# EAGLE design Bus IO and Centronics Card (EAGLE 6.5.0)
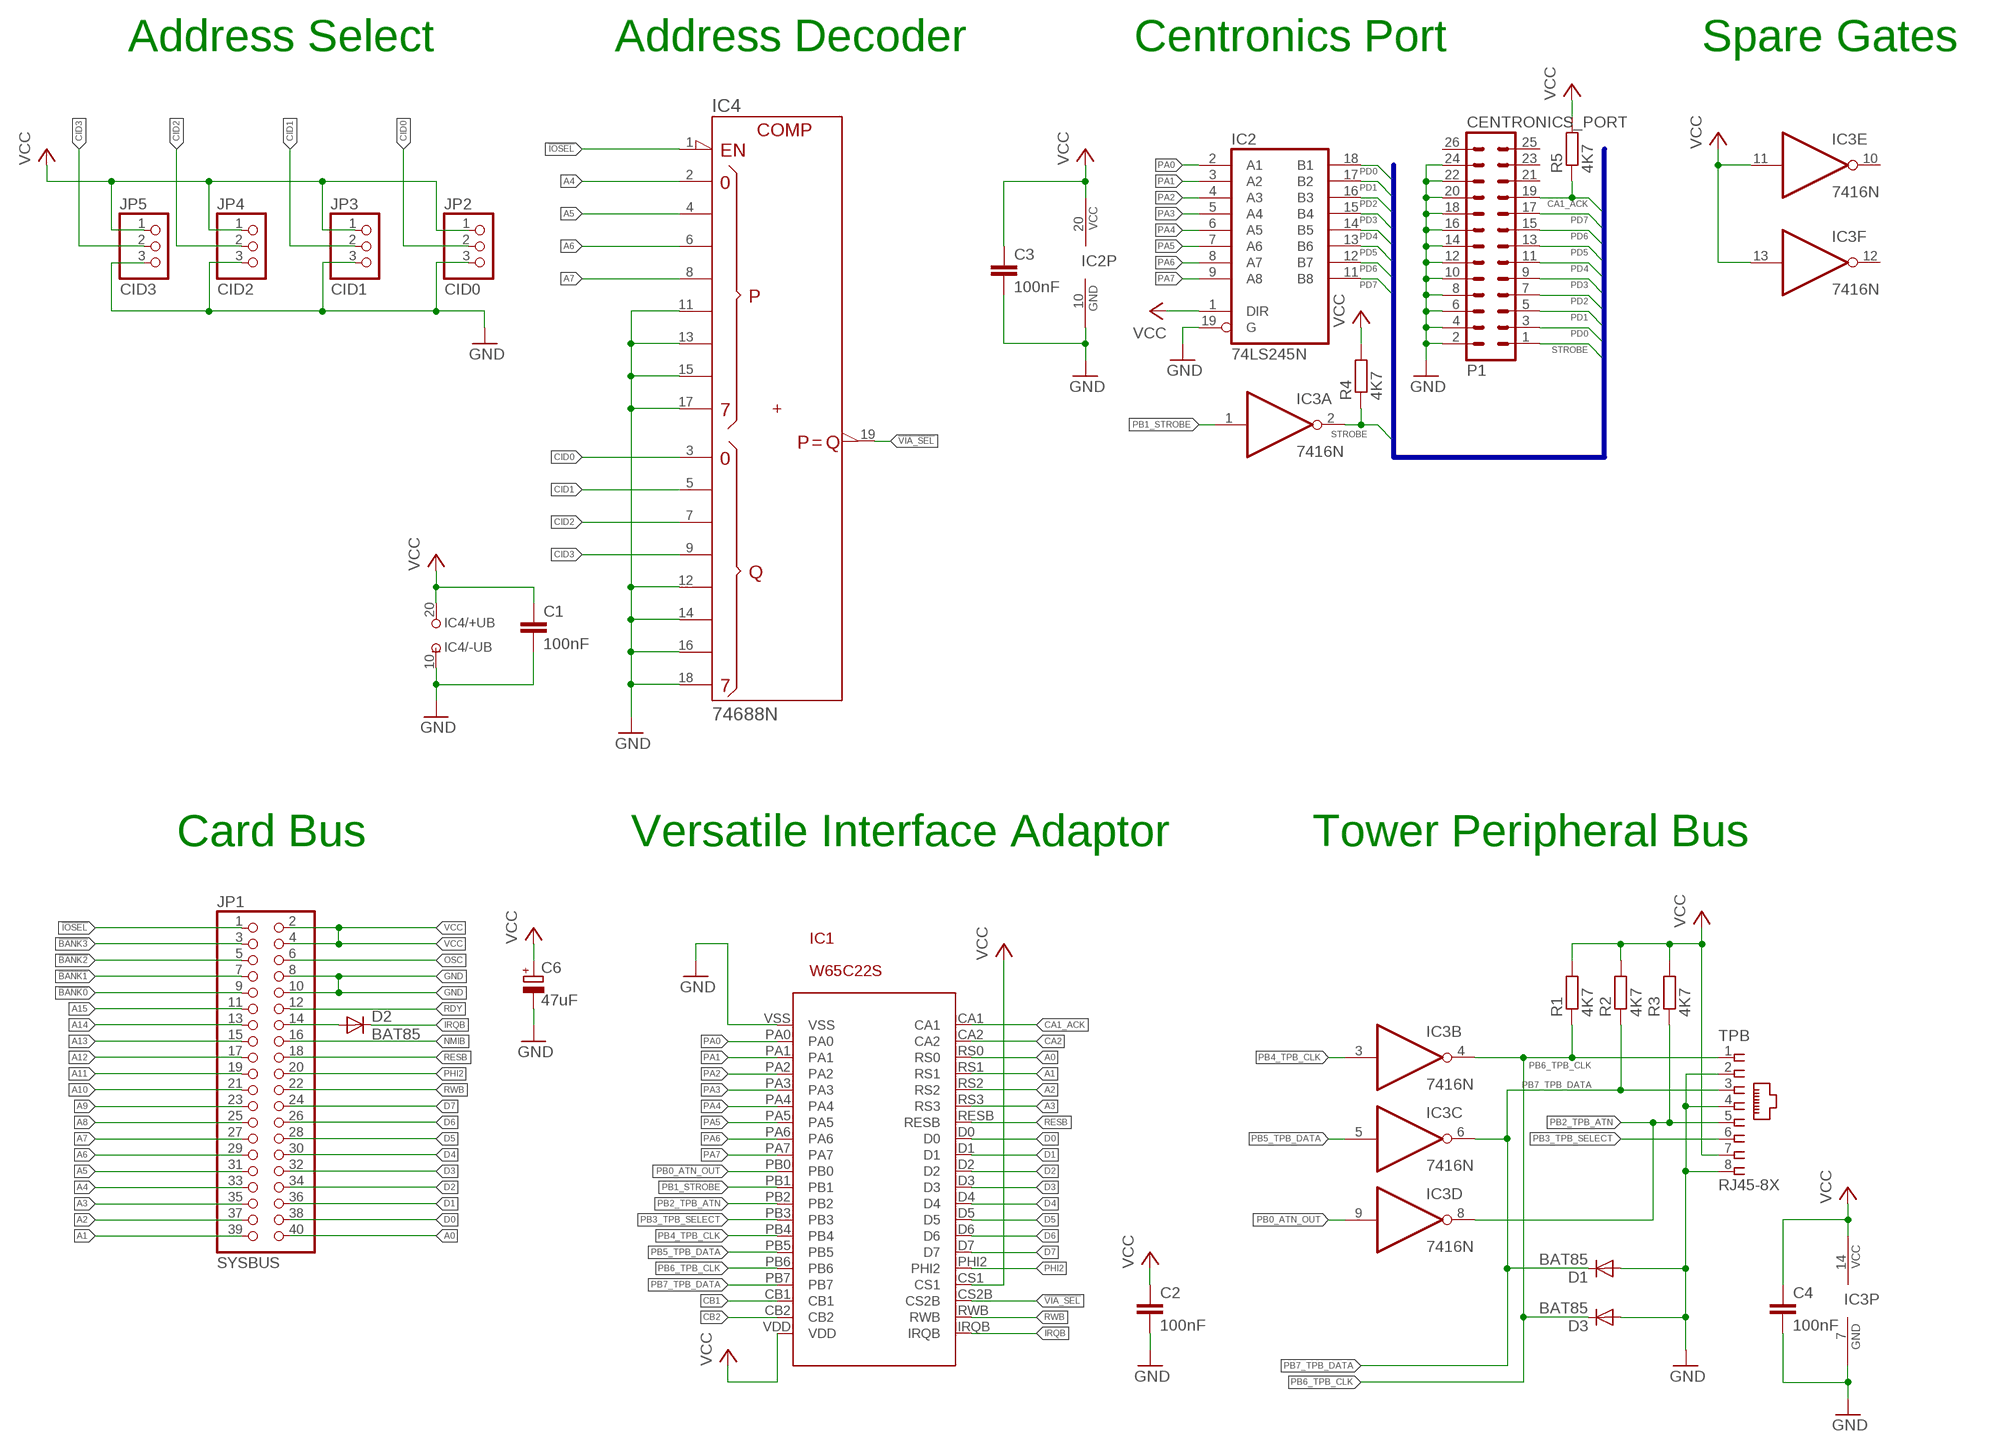
[diagram p0: schematic, sheet 1]

## Parts
C1  100nF  C-EU050-025X075  [C050-025X075]
C2  100nF  C-EU050-025X075  [C050-025X075]
C3  100nF  C-EU050-025X075  [C050-025X075]
C4  100nF  C-EU050-025X075  [C050-025X075]
C6  47uF  CPOL-EUE2.5-7  [E2,5-7]
CENTRONICS_PORT  P1  ML26L  [ML26L]
D1  BAT85  BAT81  [DO34-7]
D2  BAT85  BAT81  [DO34-7]
D3  BAT85  BAT81  [DO34-7]
IC1  W65C22S  W65C22  [W65C22-DIP]
IC2  74LS245N  [DIL20]
IC3  7416N  [DIL14]
IC4  74688N  [DIL20]
JP1  SYSBUS  PINHD-2X20/90  [2X20/90]
JP2  CID0  PINHD-1X3  [1X03]
JP3  CID1  PINHD-1X3  [1X03]
JP4  CID2  PINHD-1X3  [1X03]
JP5  CID3  PINHD-1X3  [1X03]
R1  4K7  R-EU_0207/10  [0207/10]
R2  4K7  R-EU_0207/10  [0207/10]
R3  4K7  R-EU_0207/10  [0207/10]
R4  4K7  R-EU_0207/10  [0207/10]
R5  4K7  R-EU_0207/10  [0207/10]
TPB  RJ45-8X  [RJ45-NO-SHIELD]

## Nets
!BANK0: JP1.9
!BANK1: JP1.7
!BANK2: JP1.5
!BANK3: JP1.3
!IOSEL: IC4.1(!G) JP1.1
!VIA_SEL: IC1.CS2B IC4.19(!P=Q)
A0: IC1.RS0 JP1.40
A1: IC1.RS1 JP1.39
A2: IC1.RS2 JP1.37
A3: IC1.RS3 JP1.35
A4: IC4.2(P0) JP1.33
A5: IC4.4(P1) JP1.31
A6: IC4.6(P2) JP1.29
A7: IC4.8(P3) JP1.27
A8: JP1.25
A9: JP1.23
A10: JP1.21
A11: JP1.19
A12: JP1.17
A13: JP1.15
A14: JP1.13
A15: JP1.11
CA1_ACK: CENTRONICS_PORT.19 IC1.CA1 R5.1
CA2: IC1.CA2
CB1: IC1.CB1
CB2: IC1.CB2
CID0: IC4.3(Q0) JP2.2
CID1: IC4.5(Q1) JP3.2
CID2: IC4.7(Q2) JP4.2
CID3: IC4.9(Q3) JP5.2
D0: IC1.D0 JP1.38
D1: IC1.D1 JP1.36
D2: IC1.D2 JP1.34
D3: IC1.D3 JP1.32
D4: IC1.D4 JP1.30
D5: IC1.D5 JP1.28
D6: IC1.D6 JP1.26
D7: IC1.D7 JP1.24
GND: C1.2 C2.2 C3.2 C4.2 C6.- CENTRONICS_PORT.2 CENTRONICS_PORT.4 CENTRONICS_PORT.6 CENTRONICS_PORT.8 CENTRONICS_PORT.10 CENTRONICS_PORT.12 CENTRONICS_PORT.14 CENTRONICS_PORT.16 CENTRONICS_PORT.18 CENTRONICS_PORT.20 CENTRONICS_PORT.22 CENTRONICS_PORT.24 D1.A D3.A IC1.VSS IC2.10(GND) IC2.19(G) IC3.7(P:GND) IC4.10(-UB) IC4.11(P4) IC4.12(Q4) IC4.13(P5) IC4.14(Q5) IC4.15(P6) IC4.16(Q6) IC4.17(P7) IC4.18(Q7) JP1.8 JP1.10 JP2.3 JP3.3 JP4.3 JP5.3 TPB.2 TPB.4 TPB.8
IRQB: D2.C IC1.IRQB
N$1: D2.A JP1.14
NMIB: JP1.16
OSC: JP1.6
PA0: IC1.PA0 IC2.2(A1)
PA1: IC1.PA1 IC2.3(A2)
PA2: IC1.PA2 IC2.4(A3)
PA3: IC1.PA3 IC2.5(A4)
PA4: IC1.PA4 IC2.6(A5)
PA5: IC1.PA5 IC2.7(A6)
PA6: IC1.PA6 IC2.8(A7)
PA7: IC1.PA7 IC2.9(A8)
PB0_ATN_OUT: IC1.PB0 IC3.9(D:I)
PB1_STROBE: IC1.PB1 IC3.1(A:I)
PB2_TPB_ATN: IC1.PB2 IC3.8(D:O) R3.1 TPB.5
PB3_TPB_SELECT: IC1.PB3 TPB.6
PB4_TPB_CLK: IC1.PB4 IC3.3(B:I)
PB5_TPB_DATA: IC1.PB5 IC3.5(C:I)
PB6_TPB_CLK: D3.C IC1.PB6 IC3.4(B:O) R1.1 TPB.1
PB7_TPB_DATA: D1.C IC1.PB7 IC3.6(C:O) R2.1 TPB.3
PD0: CENTRONICS_PORT.3 IC2.18(B1)
PD1: CENTRONICS_PORT.5 IC2.17(B2)
PD2: CENTRONICS_PORT.7 IC2.16(B3)
PD3: CENTRONICS_PORT.9 IC2.15(B4)
PD4: CENTRONICS_PORT.11 IC2.14(B5)
PD5: CENTRONICS_PORT.13 IC2.13(B6)
PD6: CENTRONICS_PORT.15 IC2.12(B7)
PD7: CENTRONICS_PORT.17 IC2.11(B8)
PHI2: IC1.PHI2 JP1.20
RDY: JP1.12
RESB: IC1.RESB JP1.18
RWB: IC1.RWB JP1.22
STROBE: CENTRONICS_PORT.1 IC3.2(A:O) R4.1
VCC: C1.1 C2.1 C3.1 C4.1 C6.+ IC1.CS1 IC1.VDD IC2.1(DIR) IC2.20(VCC) IC3.11(E:I) IC3.13(F:I) IC3.14(P:VCC) IC4.20(+UB) JP1.2 JP1.4 JP2.1 JP3.1 JP4.1 JP5.1 R1.2 R2.2 R3.2 R4.2 R5.2 TPB.7
Unconnected: CENTRONICS_PORT.21 CENTRONICS_PORT.23 CENTRONICS_PORT.25 CENTRONICS_PORT.26 IC3.10(E:O) IC3.12(F:O)

## Buses
PD[0..7],STROBE,CA1_ACK

## Notes on the sheet
- Address Select | Address Decoder | Centronics Port | Spare Gates
- Card Bus | Versatile Interface Adaptor | Tower Peripheral Bus

## Library data of the parts
C1-C4 = rcl:C-EU: CAPACITOR, European symbol
C6 = rcl:CPOL-EU: POLARIZED CAPACITOR, European symbol
CENTRONICS_PORT = con-ml:ML26L: HARTING; OC_FARNELL: unknown; OC_NEWARK: unknown
D1-D3 = diode:BAT81: DIODE barrier diode
IC1 = W65XX Support:W65C22
IC2 = 74xx-us:74*245: Octal BUS TRANSCEIVER, 3-state
IC3 = 74xx-us:74*16: Hex INVERTER, open collector, high-voltage
IC4 = 74ttl-din:74*688: 8-bit MAGNITUDE/IDENTITY COMPARATOR, totem pole
JP1 = pinhead:PINHD-2X20: PIN HEADER
JP2-JP5 = pinhead:PINHD-1X3: PIN HEADER
R1-R5 = rcl:R-EU_: RESISTOR, European symbol
TPB = con-tycoelectronics:RJ45: CORCOM Modular RJ Jacks No Shield Source: www.tycoelectronics.com .. ENG_DS_1654001_1099_RJ_L_0507.pdf; MPN: RJ45-8X; OC_FARNELL: unknown; OC_NEWARK: 16R6101

## Board
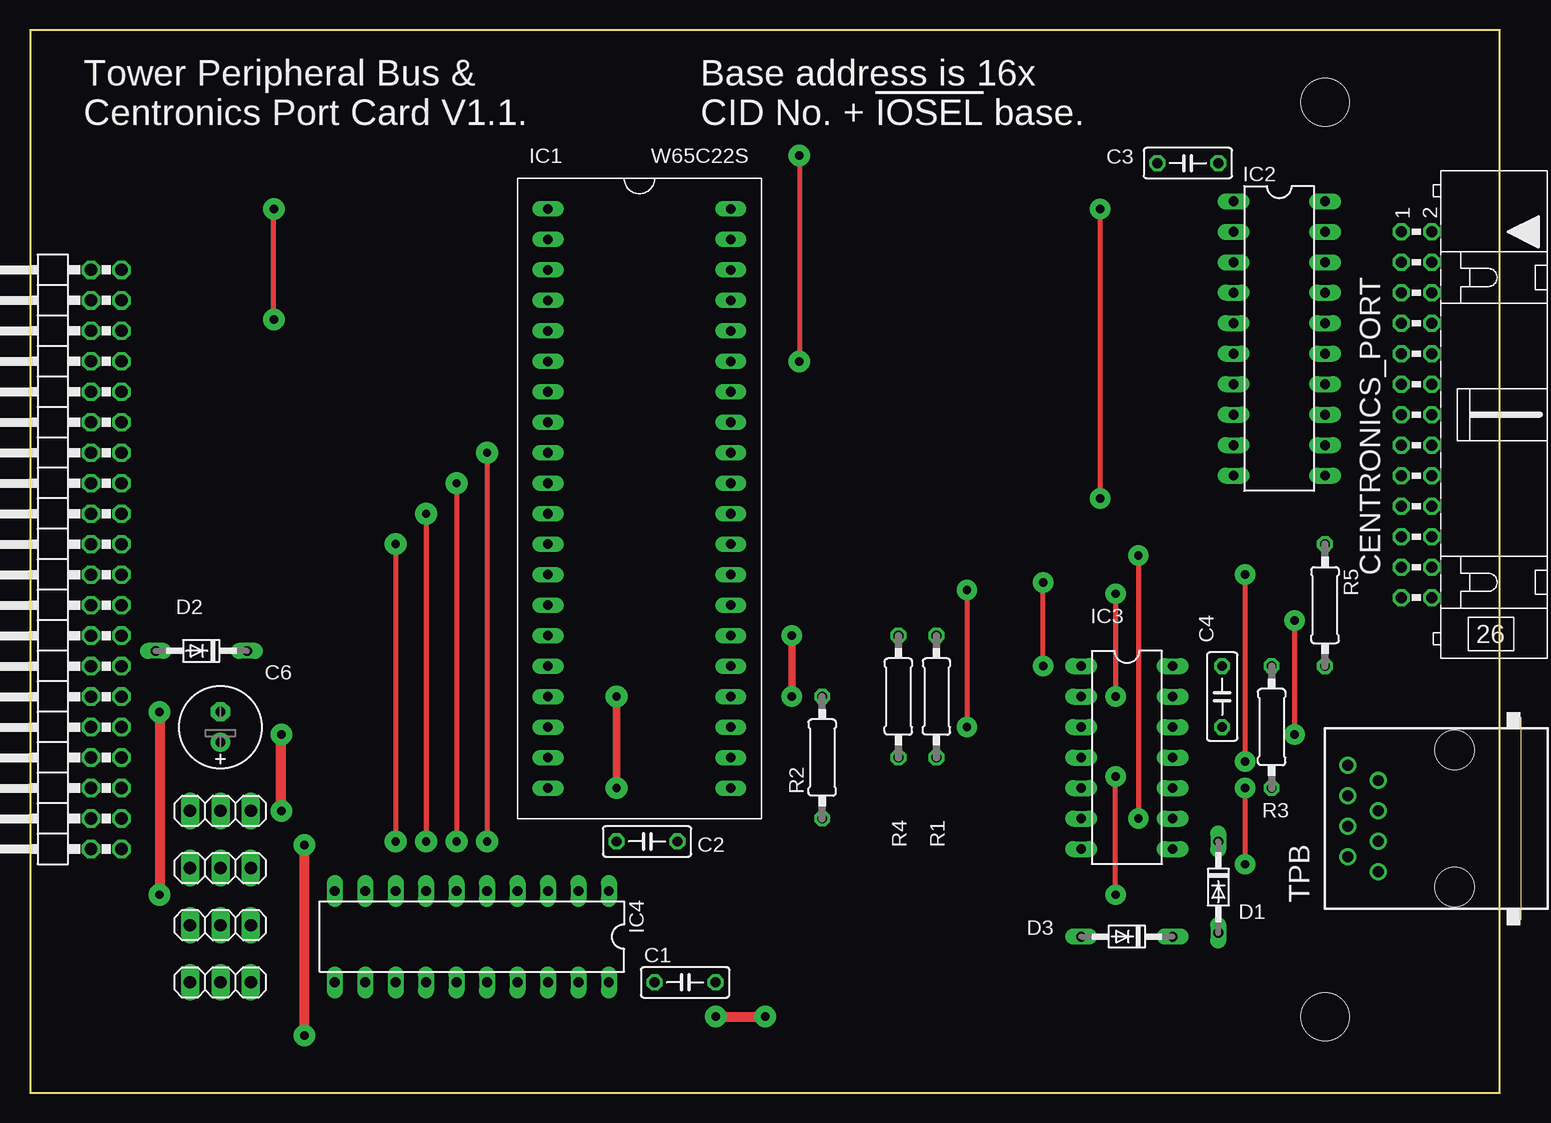
[diagram p1: board, top side]
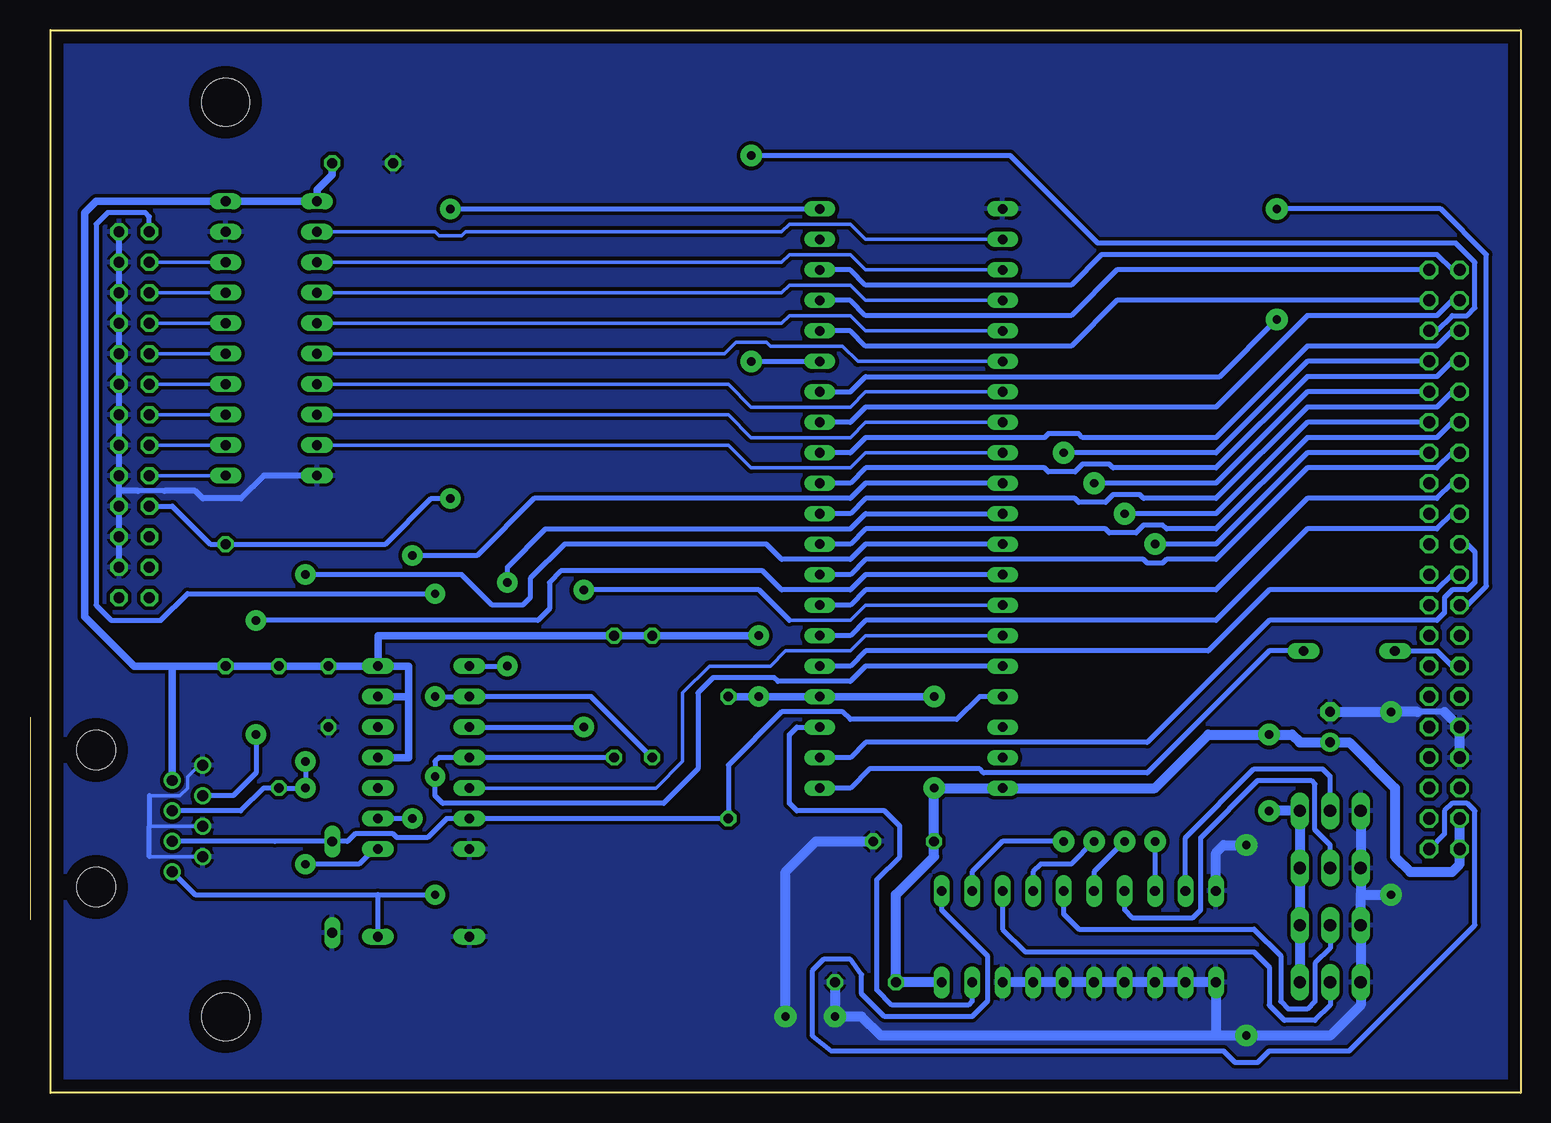
[diagram p2: board, bottom side, seen from below]

Size 122.53 x 88.57 mm. Coordinates in mm from the lower left corner, seen from the top.
Outline: 0,0 122.53,0 122.53,88.57 0,88.57 0,0
Copper layers (1*16): Top 0.035mm / dielectric 1.5mm / Bottom 0.035mm
Design rules "default *": minimum track width 10mil, minimum drill 24mil, track to track 8mil, track to pad 8mil, pad to pad 8mil, via to via 8mil, smd to smd 8mil, copper to edge 40mil, drill to drill 8mil, minimum pad ring 10mil, minimum via ring 8mil, stop-mask expansion 4mil, vias tented up to drill 0mil, thermal gap 10mil
Holes 4 mm at 107.95,82.55 107.95,6.35

### Footprints (pad centres in the part's own frame; a part is rotated, then mirrored left to right if it is on the bottom)
C050-025X075 = drill 0.813 octagon: 1 -2.54,0; 2 2.54,0
E2,5-7 = drill 0.813 pad 1.6: + -1.27,0 | drill 0.813 pad 1.6 octagon: - 1.27,0
ML26L = drill 0.914 octagon: 1 -15.24,-1.27; 2 -15.24,1.27; 3 -12.7,-1.27; 4 -12.7,1.27; 5 -10.16,-1.27; 6 -10.16,1.27; 7 -7.62,-1.27; 8 -7.62,1.27; 9 -5.08,-1.27; 10 -5.08,1.27; 11 -2.54,-1.27; 12 -2.54,1.27; 13 0,-1.27; 14 0,1.27; 15 2.54,-1.27; 16 2.54,1.27; 17 5.08,-1.27; 18 5.08,1.27; 19 7.62,-1.27; 20 7.62,1.27; 21 10.16,-1.27; 22 10.16,1.27; 23 12.7,-1.27; 24 12.7,1.27; 25 15.24,-1.27; 26 15.24,1.27
DO34-7 = drill 0.813 long: A 3.81,0; C -3.81,0
W65C22-DIP = drill 0.8 long: CA1 7.62,24.13; CA2 7.62,21.59; CB1 -7.62,-19.05; CB2 -7.62,-21.59; CS1 7.62,-16.51; CS2B 7.62,-19.05; D0 7.62,6.35; D1 7.62,3.81; D2 7.62,1.27; D3 7.62,-1.27; D4 7.62,-3.81; D5 7.62,-6.35; D6 7.62,-8.89; D7 7.62,-11.43; IRQB 7.62,-24.13; PA0 -7.62,21.59; PA1 -7.62,19.05; PA2 -7.62,16.51; PA3 -7.62,13.97; PA4 -7.62,11.43; PA5 -7.62,8.89; PA6 -7.62,6.35; PA7 -7.62,3.81; PB0 -7.62,1.27; PB1 -7.62,-1.27; PB2 -7.62,-3.81; PB3 -7.62,-6.35; PB4 -7.62,-8.89; PB5 -7.62,-11.43; PB6 -7.62,-13.97; PB7 -7.62,-16.51; PHI2 7.62,-13.97; RESB 7.62,8.89; RS0 7.62,19.05; RS1 7.62,16.51; RS2 7.62,13.97; RS3 7.62,11.43; RWB 7.62,-21.59; VDD -7.62,-24.13; VSS -7.62,24.13
DIL20 = drill 0.813 long: 1 -11.43,-3.81; 2 -8.89,-3.81; 3 -6.35,-3.81; 4 -3.81,-3.81; 5 -1.27,-3.81; 6 1.27,-3.81; 7 3.81,-3.81; 8 6.35,-3.81; 9 8.89,-3.81; 10 11.43,-3.81; 11 11.43,3.81; 12 8.89,3.81; 13 6.35,3.81; 14 3.81,3.81; 15 1.27,3.81; 16 -1.27,3.81; 17 -3.81,3.81; 18 -6.35,3.81; 19 -8.89,3.81; 20 -11.43,3.81
DIL14 = drill 0.813 long: 1 -7.62,-3.81; 2 -5.08,-3.81; 3 -2.54,-3.81; 4 0,-3.81; 5 2.54,-3.81; 6 5.08,-3.81; 7 7.62,-3.81; 8 7.62,3.81; 9 5.08,3.81; 10 2.54,3.81; 11 0,3.81; 12 -2.54,3.81; 13 -5.08,3.81; 14 -7.62,3.81
2X20/90 = drill 1.016 octagon: 1 -24.13,-6.35; 2 -24.13,-3.81; 3 -21.59,-6.35; 4 -21.59,-3.81; 5 -19.05,-6.35; 6 -19.05,-3.81; 7 -16.51,-6.35; 8 -16.51,-3.81; 9 -13.97,-6.35; 10 -13.97,-3.81; 11 -11.43,-6.35; 12 -11.43,-3.81; 13 -8.89,-6.35; 14 -8.89,-3.81; 15 -6.35,-6.35; 16 -6.35,-3.81; 17 -3.81,-6.35; 18 -3.81,-3.81; 19 -1.27,-6.35; 20 -1.27,-3.81; 21 1.27,-6.35; 22 1.27,-3.81; 23 3.81,-6.35; 24 3.81,-3.81; 25 6.35,-6.35; 26 6.35,-3.81; 27 8.89,-6.35; 28 8.89,-3.81; 29 11.43,-6.35; 30 11.43,-3.81; 31 13.97,-6.35; 32 13.97,-3.81; 33 16.51,-6.35; 34 16.51,-3.81; 35 19.05,-6.35; 36 19.05,-3.81; 37 21.59,-6.35; 38 21.59,-3.81; 39 24.13,-6.35; 40 24.13,-3.81
1X03 = drill 1.016 long: 1 -2.54,0; 2 0,0; 3 2.54,0
0207/10 = drill 0.813 octagon: 1 -5.08,0; 2 5.08,0
RJ45-NO-SHIELD = drill 0.9 pad 1.4: 1 -4.445,6.35; 2 -3.175,8.89; 3 -1.905,6.35; 4 -0.635,8.89; 5 0.635,6.35; 6 1.905,8.89; 7 3.175,6.35; 8 4.445,8.89 | hole 3.251: -5.715,0; 5.715,0

### Placement (x,y rotation side)
C1  54.61,9.21 0 top
C2  51.44,20.95 0 top
C3  96.52,77.47 180 top
C4  99.38,33.02 270 top
C6  15.88,30.48 90 top
CENTRONICS_PORT  115.57,56.52 270 top
D1  99.06,17.14 270 top
D2  14.29,36.83 180 top
D3  91.44,13.02 180 top
IC1  50.8,49.53 0 top
IC2  104.14,62.87 270 top
IC3  91.44,27.94 270 top
IC4  36.83,13.02 180 top
JP1  1.27,44.45 90 top
JP2  15.88,9.21 180 top
JP3  15.88,13.97 180 top
JP4  15.88,18.73 180 top
JP5  15.88,23.5 180 top
R1  75.56,33.02 90 top
R2  66.04,27.94 90 top
R3  103.5,30.48 90 top
R4  72.39,33.02 90 top
R5  107.95,40.64 270 top
TPB  118.75,22.86 90 top

### Tracks (layer width: path | path; a pad name or v marks a point on that pad's centre or on a via)
!IOSEL
  Bottom 0.406: IC4.1 48.26,15.24 44.45,11.43 44.45,7.62 45.72,6.35 53.02,6.35 54.93,8.26 54.93,9.84 55.88,11.11 58.1,11.11 59.05,10.16 59.05,4.76 57.47,3.49 24.77,3.49 23.81,2.54 21.91,2.54 20.95,3.49 14.29,3.49 3.81,13.97 3.81,23.5 4.45,24.13 5.71,24.13 6.35,23.5 6.35,21.59 JP1.1
!VIA_SEL
  Bottom 0.406: IC4.19 45.72,7.62 46.04,7.3 52.39,7.3 53.66,8.57 53.66,17.78 51.75,19.68 51.75,22.23 53.02,23.5 60.33,23.5 60.96,24.13 60.96,29.84 60.33,30.48 IC1.CS2B
A0
  Bottom 0.406: JP1.40 5.71,68.58 6.99,69.85 34.92,69.85 37.47,67.31 54.61,67.31 55.88,68.58 IC1.RS0
A1
  Bottom 0.406: JP1.39 33.66,68.58 37.47,64.77 54.61,64.77 55.88,66.04 IC1.RS1
A2
  Bottom 0.406: JP1.37 33.66,66.04 37.47,62.23 54.61,62.23 55.88,63.5 IC1.RS2
A3  (via drill 0.7 pad 1.8)
  Top 0.406: v64.14,78.11 v64.14,60.96
  Bottom 0.406: JP1.35 6.99,63.5 5.71,64.77 4.45,64.77 3.81,65.41 3.81,69.22 5.4,70.8 35.24,70.8 42.55,78.11 v64.14,78.11 | v64.14,60.96 IC1.RS3
A4  (via drill 0.7 pad 1.8)
  Top 0.406: v38.1,53.34 v38.1,20.95
  Bottom 0.406: JP1.33 17.78,60.96 25.4,53.34 v38.1,53.34 | v38.1,20.95 43.18,20.95 45.72,18.41 IC4.2
A5  (via drill 0.7 pad 1.8)
  Top 0.406: v35.56,50.8 v35.56,20.95
  Bottom 0.406: JP1.31 17.78,58.42 25.4,50.8 v35.56,50.8 | IC4.4 40.64,18.41 40.01,19.05 37.47,19.05 v35.56,20.95
A6  (via drill 0.7 pad 1.8)
  Top 0.406: v33.02,48.26 v33.02,20.95
  Bottom 0.406: JP1.29 17.78,55.88 25.4,48.26 v33.02,48.26 | v33.02,20.95 35.56,18.41 IC4.6
A7  (via drill 0.7 pad 1.8)
  Top 0.406: v30.48,45.72 v30.48,20.95
  Bottom 0.406: JP1.27 17.78,53.34 25.4,45.72 v30.48,45.72 | v30.48,20.95 IC4.8
CA1_ACK  (via drill 0.7 pad 1.7)
  Top 0.406: v89.22,49.53 v89.22,73.66
  Bottom 0.406: CENTRONICS_PORT.19 112.39,48.9 109.22,45.72 R5.1 94.61,45.72 90.81,49.53 v89.22,49.53 | v89.22,73.66 IC1.CA1
CID0
  Bottom 0.406: JP2.2 15.88,7.3 17.14,6.03 19.68,6.03 20.95,7.3 20.95,10.48 22.23,11.75 41.27,11.75 43.18,13.65 IC4.3
CID1
  Bottom 0.406: JP3.2 15.88,12.06 17.14,10.79 17.14,7.62 17.78,6.99 19.37,6.99 20,7.62 20,11.43 22.23,13.65 36.83,13.65 38.1,14.92 IC4.5
CID2
  Bottom 0.406: JP4.2 15.88,20.64 17.14,21.91 17.14,25.72 17.46,26.04 21.91,26.04 26.67,21.27 26.67,15.24 27.3,14.61 32.38,14.61 33.02,15.24 IC4.7
CID3
  Bottom 0.406: JP5.2 15.88,26.35 16.51,26.99 22.23,26.99 27.94,21.27 IC4.9
D0
  Bottom 0.406: JP1.38 5.71,66.04 6.99,64.77 17.78,64.77 25.4,57.15 54.61,57.15 55.88,55.88 IC1.D0
D1
  Bottom 0.406: JP1.36 5.71,63.5 6.99,62.23 17.78,62.23 25.4,54.61 36.51,54.61 36.83,54.93 39.37,54.93 39.69,54.61 54.61,54.61 55.88,53.34 IC1.D1
D2
  Bottom 0.406: JP1.34 5.71,60.96 6.99,59.69 17.78,59.69 25.4,52.07 33.97,52.07 34.29,52.39 36.51,52.39 37.15,51.75 39.37,51.75 39.69,52.07 54.61,52.07 55.88,50.8 IC1.D2
D3
  Bottom 0.406: JP1.32 5.71,58.42 6.99,57.15 17.78,57.15 25.4,49.53 31.43,49.53 31.75,49.85 33.97,49.85 34.61,49.21 36.83,49.21 37.15,49.53 54.61,49.53 55.88,48.26 IC1.D3
D4
  Bottom 0.406: JP1.30 5.71,55.88 6.99,54.61 17.78,54.61 25.4,46.99 29.53,46.99 29.84,47.31 31.43,47.31 32.07,46.67 34.29,46.67 34.61,46.99 54.61,46.99 55.88,45.72 IC1.D4
D5
  Bottom 0.406: JP1.28 5.71,53.34 6.99,52.07 17.78,52.07 25.4,44.45 29.53,44.45 29.84,44.13 31.11,44.13 31.43,44.45 54.61,44.45 55.88,43.18 IC1.D5
D6
  Bottom 0.406: JP1.26 5.71,50.8 6.99,49.53 17.78,49.53 25.4,41.91 54.61,41.91 55.88,40.64 IC1.D6
D7
  Bottom 0.406: JP1.24 5.71,48.26 6.99,46.99 17.78,46.99 25.4,39.37 54.61,39.37 55.88,38.1 IC1.D7
GND  (via drill 0.7 pad 1.8)
  Top 0.813: v22.86,20.64 v22.86,4.76 | v57.15,6.35 v61.28,6.35 | v10.79,31.75 v10.79,16.51
  Bottom 0.305: TPB.4 114.3,22.23 | TPB.2 114.3,19.68 | 110.17,27.3 111.12,26.35 111.12,25.4 111.76,24.77 114.3,24.77
  Bottom 0.406: 113.03,50.16 115.25,50.16 | 114.3,19.68 114.3,22.23 114.3,24.77 | TPB.8 110.17,27.3
  Bottom 0.508: 6.35,31.75 8.57,31.75 | CENTRONICS_PORT.24 CENTRONICS_PORT.22 CENTRONICS_PORT.20 116.84,50.16 | 116.84,50.16 CENTRONICS_PORT.18 CENTRONICS_PORT.16 CENTRONICS_PORT.14 CENTRONICS_PORT.12 CENTRONICS_PORT.10 CENTRONICS_PORT.8 CENTRONICS_PORT.6 CENTRONICS_PORT.4 CENTRONICS_PORT.2 | IC2.10 104.78,51.44 106.68,49.53 109.86,49.53 110.49,50.16 113.03,50.16 | 115.25,50.16 116.84,50.16
  Bottom 0.813: IC4.18 IC4.17 IC4.16 IC4.15 IC4.14 IC4.13 IC4.12 IC4.11 25.4,4.76 | JP5.3 JP4.3 13.34,16.51 | 25.4,4.76 v22.86,4.76 15.88,4.76 13.34,7.3 JP2.3 JP3.3 13.34,16.51 | 25.4,4.76 53.34,4.76 54.93,6.35 v57.15,6.35 C1.2 | IC4.10 25.4,20 24.77,20.64 v22.86,20.64 | 6.35,31.75 JP1.10 JP1.8 | v61.28,6.35 61.28,18.41 58.74,20.95 C2.2 | C6.- v10.79,31.75 8.57,31.75 | 13.34,16.51 v10.79,16.51
  pour Bottom (isolate 0.305): 0,88.9 122.56,88.9 122.56,0 0,0
IRQB
  Bottom 0.406: IC1.IRQB 55.88,25.4 54.29,26.99 45.09,26.99 44.77,26.67 31.11,26.67 20.95,36.83 D2.C
N$1
  Bottom 0.406: JP1.14 5.71,35.56 6.99,36.83 D2.A
PA0
  Bottom 0.305: IC1.PA0 54.61,71.12 55.88,72.39 60.96,72.39 61.59,71.75 87.95,71.75 88.27,71.44 90.17,71.44 90.49,71.75 IC2.2
PA1
  Bottom 0.305: IC1.PA1 54.61,68.58 55.88,69.85 60.96,69.85 61.59,69.22 IC2.3
PA2
  Bottom 0.305: IC1.PA2 54.61,66.04 55.88,67.31 60.96,67.31 61.59,66.67 IC2.4
PA3
  Bottom 0.305: IC1.PA3 54.61,63.5 55.88,64.77 60.96,64.77 61.59,64.14 IC2.5
PA4
  Bottom 0.305: IC1.PA4 55.24,60.96 56.52,62.23 62.55,62.23 62.87,62.55 65.41,62.55 66.36,61.59 IC2.6
PA5
  Bottom 0.305: IC1.PA5 54.61,58.42 55.88,57.15 64.14,57.15 66.04,59.05 IC2.7
PA6
  Bottom 0.305: IC1.PA6 54.61,55.88 55.88,54.61 64.14,54.61 66.04,56.52 IC2.8
PA7
  Bottom 0.305: IC1.PA7 54.61,53.34 55.88,52.07 64.14,52.07 66.04,53.98 IC2.9
PB0_ATN_OUT  (via drill 0.7 pad 1.7)
  Top 0.406: v92.39,44.77 v92.39,22.86
  Bottom 0.406: IC1.PB0 54.61,50.8 55.88,49.53 82.23,49.53 87,44.77 v92.39,44.77 | v92.39,22.86 IC3.9
PB1_STROBE  (via drill 0.7 pad 1.7)
  Top 0.406: v84.45,35.56 v84.45,42.55
  Bottom 0.406: IC3.1 v84.45,35.56 | v84.45,42.55 84.45,43.81 81.28,46.99 55.88,46.99 54.61,48.26 IC1.PB1
PB2_TPB_ATN  (via drill 0.7 pad 1.7)
  Top 0.406: v101.28,43.18 v101.28,27.62 | v101.28,25.4 v101.28,19.05
  Bottom 0.406: TPB.5 106.68,23.5 104.78,25.4 R3.1 v101.28,25.4 v101.28,27.62 | IC1.PB2 54.61,45.72 55.88,44.45 61.59,44.45 62.87,45.72 79.69,45.72 82.55,42.86 82.55,41.27 83.19,40.64 85.72,40.64 88.27,43.18 v101.28,43.18 | IC3.8 95.57,20.32 96.84,19.05 v101.28,19.05
PB3_TPB_SELECT  (via drill 0.7 pad 1.7)
  Top 0.406: v105.41,39.37 v105.41,29.84
  Bottom 0.406: IC1.PB3 54.61,43.18 55.88,41.91 61.59,41.91 63.18,43.5 80.01,43.5 80.96,42.55 80.96,40.32 81.92,39.37 v105.41,39.37 | v105.41,29.84 105.41,26.67 107.31,24.77 TPB.6
PB4_TPB_CLK  (via drill 0.7 pad 1.7)
  Top 0.406: v78.11,41.91 v78.11,30.48
  Bottom 0.305: IC1.PB4 54.61,40.64 55.88,39.37 60.96,39.37
  Bottom 0.406: IC3.3 v78.11,30.48 | 60.96,39.37 63.5,41.91 v78.11,41.91
PB5_TPB_DATA
  Bottom 0.305: IC1.PB5 54.61,38.1 55.88,36.83 61.28,36.83 62.55,35.56 67.63,35.56 69.85,33.34 69.85,27.62 72.07,25.4 IC3.5
PB6_TPB_CLK  (via drill 0.7 pad 1.7)
  Top 0.406: v90.49,16.51 v90.49,26.35
  Bottom 0.406: IC1.PB6 54.61,35.56 55.88,34.29 61.91,34.29 62.23,34.61 67.31,34.61 68.58,33.34 68.58,26.99 71.44,24.13 89.85,24.13 90.49,24.77 v90.49,26.35 90.49,27.62 90.17,27.94 IC3.4 R1.1 | TPB.1 110.49,16.51 95.25,16.51 | 95.25,16.51 v90.49,16.51 | D3.C 95.25,16.51
PB7_TPB_DATA
  Bottom 0.406: IC1.PB7 45.09,33.02 46.99,31.11 55.88,31.11 56.52,31.75 61.59,31.75 66.04,27.3 R2.1 IC3.6 89.53,22.86 91.12,21.27 93.66,21.27 93.98,21.59 97.16,21.59 97.79,20.95 D1.C | D1.C TPB.3 | D1.C 103.82,20.95
PD0
  Bottom 0.305: IC2.18 CENTRONICS_PORT.3
PD1
  Bottom 0.305: IC2.17 CENTRONICS_PORT.5
PD2
  Bottom 0.305: IC2.16 CENTRONICS_PORT.7
PD3
  Bottom 0.305: IC2.15 CENTRONICS_PORT.9
PD4
  Bottom 0.305: IC2.14 CENTRONICS_PORT.11
PD5
  Bottom 0.305: IC2.13 CENTRONICS_PORT.13
PD6
  Bottom 0.305: IC2.12 CENTRONICS_PORT.15
PD7
  Bottom 0.305: IC2.11 CENTRONICS_PORT.17
PHI2
  Bottom 0.406: IC1.PHI2 55.88,35.56 54.61,36.83 26.04,36.83 20.95,41.91 6.99,41.91 5.71,43.18 JP1.20
RESB  (via drill 0.7 pad 1.8)
  Top 0.406: v20.32,64.45 v20.32,73.66
  Bottom 0.406: JP1.18 4.45,40.64 2.86,42.23 2.86,69.85 6.67,73.66 v20.32,73.66 | IC1.RESB 55.88,58.42 54.61,59.69 25.08,59.69 v20.32,64.45
RWB
  Bottom 0.406: JP1.22 4.45,45.72 3.81,45.09 3.81,42.55 4.45,41.91 5.71,41.91 6.35,41.27 6.35,40.01 6.99,39.37 20.95,39.37 31.11,29.21 54.61,29.21 55.88,27.94 IC1.RWB
STROBE  (via drill 0.7 pad 1.7)
  Top 0.406: v90.49,41.59 v90.49,33.02
  Bottom 0.406: CENTRONICS_PORT.1 114.3,73.03 114.62,73.34 117.79,73.34 118.75,72.39 118.75,40.64 117.47,39.37 113.35,39.37 111.12,41.59 v90.49,41.59 | v90.49,33.02 IC3.2 77.47,33.02 R4.1
VCC  (via drill 0.7 pad 1.7, 0.7 pad 1.8)
  Top 0.61: v48.9,33.02 v48.9,25.4 | v63.5,33.02 v63.5,38.1
  Top 0.813: v20.95,23.5 v20.95,29.84
  Bottom 0.61: v48.9,33.02 IC1.CS1 v63.5,33.02 R2.2 | 112.39,35.56 115.57,35.56 119.7,39.69 119.7,73.34 118.75,74.3 IC2.20 IC2.1 100.33,75.25 99.06,76.52 C3.1 | 112.39,35.56 R5.2 R3.2 C4.1 IC3.14 | TPB.7 112.39,35.56 | v63.5,38.1 R4.2 R1.2 95.25,38.1 IC3.14 | IC3.14 92.71,35.56 92.71,33.02 | 92.71,33.02 92.71,27.94 IC3.11 | IC3.13 92.71,33.02
  Bottom 0.813: JP1.4 JP1.2 5.08,19.05 5.71,18.41 9.21,18.41 10.48,19.68 10.48,25.4 14.29,29.21 C6.+ 18.41,29.21 19.05,29.84 v20.95,29.84 26.04,29.84 30.48,25.4 IC1.VDD v48.9,25.4 C2.1 48.9,19.68 52.07,16.51 C1.1 IC4.20 | JP2.1 JP3.1 JP4.1 JP5.1 v20.95,23.5

### Text on the board
tPlace: Tower Peripheral Bus & / Centronics Port Card V1.1. | Base address is 16x / CID No. + !IOSEL! base.